# EAGLE design M8330 (EAGLE 6.6.0)
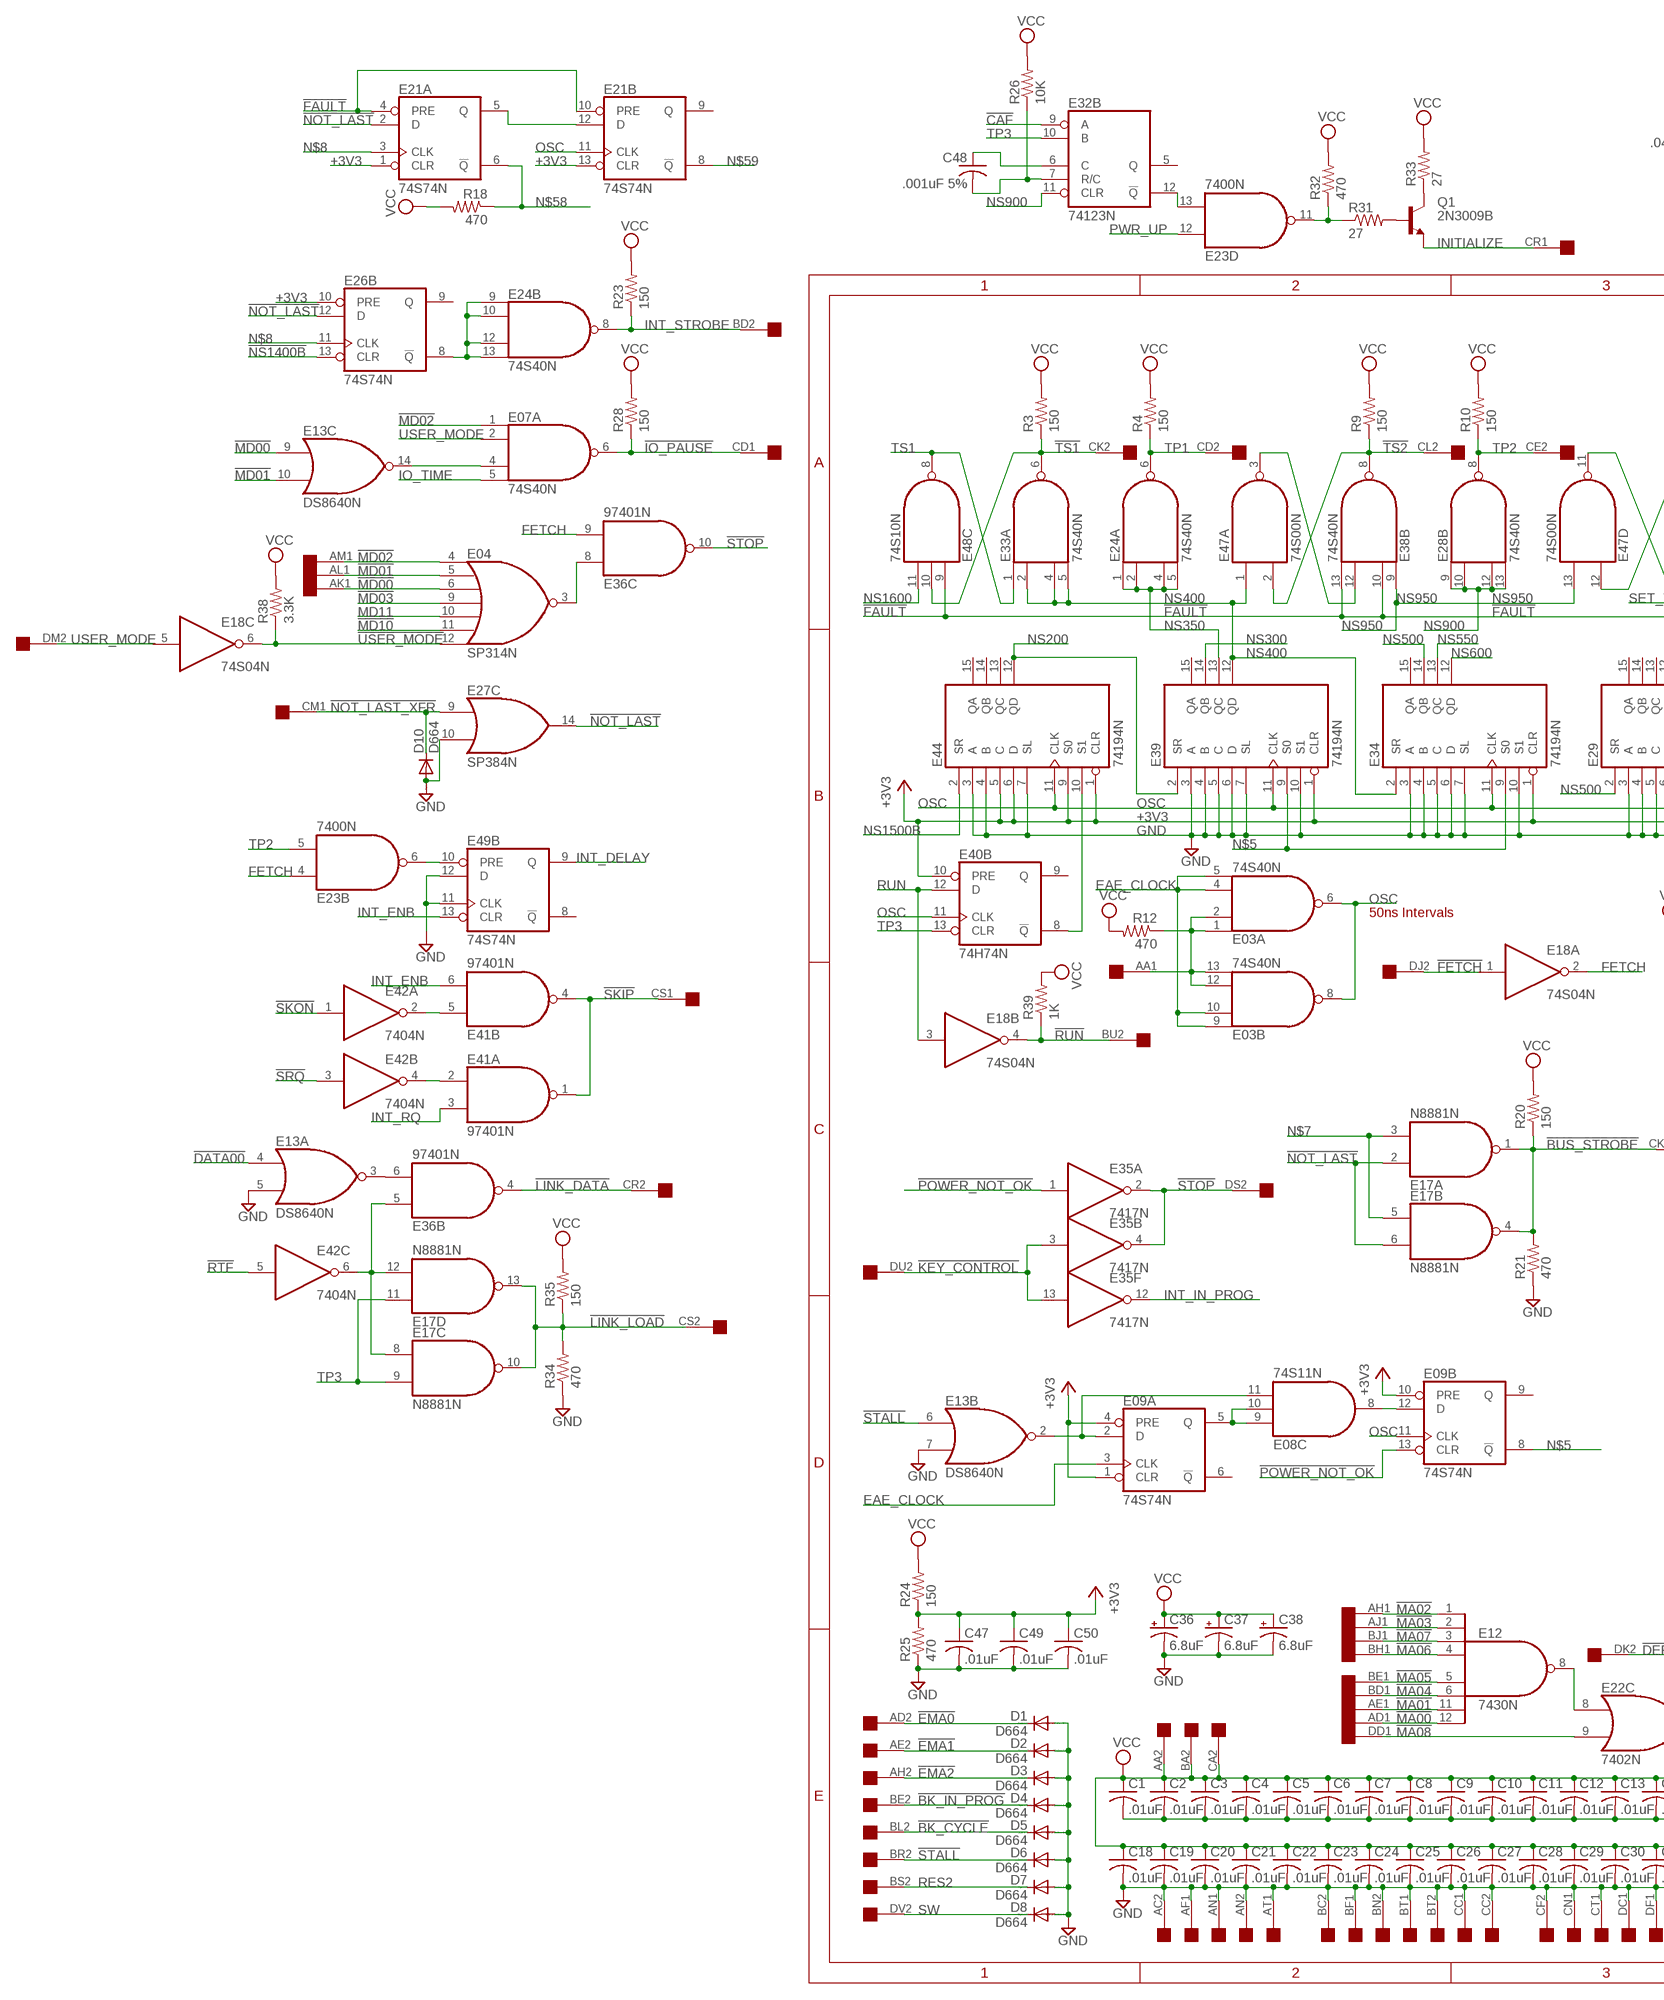
[diagram p0: schematic, sheet 1, part 1 of 2]
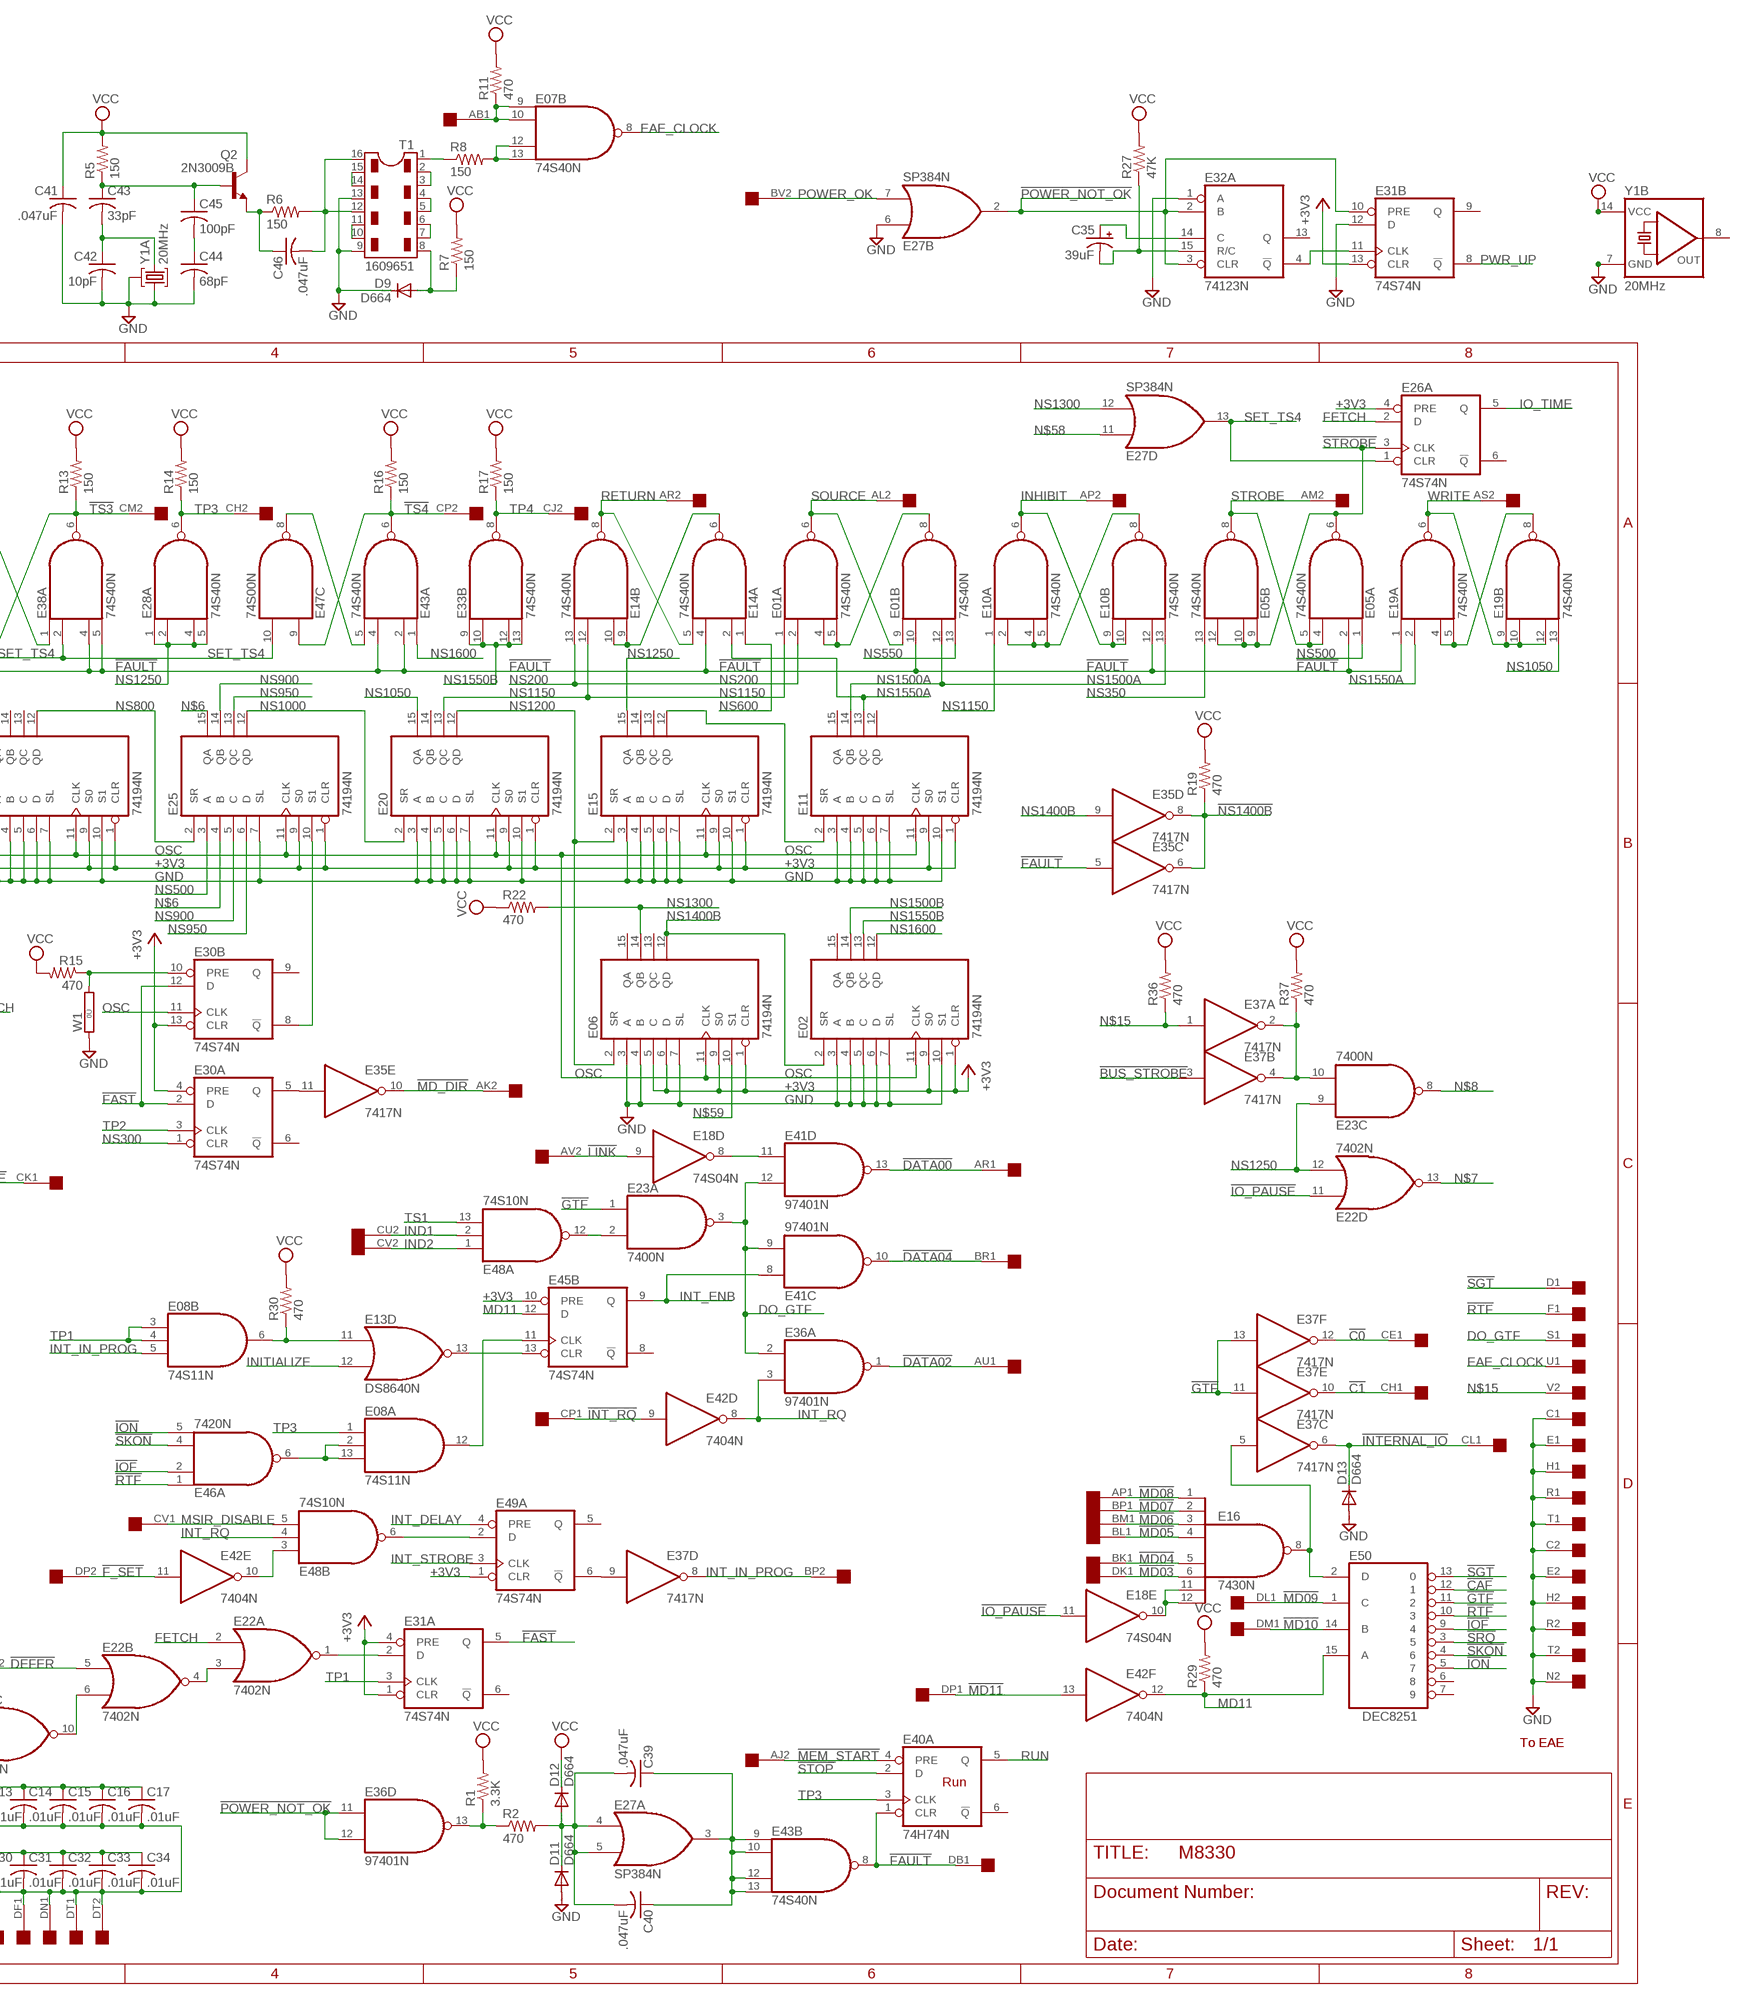
[diagram p1: schematic, sheet 1, part 2 of 2]

## Parts
C1  .01uF  C-US050-025X075  [C050-025X075]
C2  .01uF  C-US050-025X075  [C050-025X075]
C3  .01uF  C-US050-025X075  [C050-025X075]
C4  .01uF  C-US050-025X075  [C050-025X075]
C5  .01uF  C-US050-025X075  [C050-025X075]
C6  .01uF  C-US050-025X075  [C050-025X075]
C7  .01uF  C-US050-025X075  [C050-025X075]
C8  .01uF  C-US050-025X075  [C050-025X075]
C9  .01uF  C-US050-025X075  [C050-025X075]
C10  .01uF  C-US050-025X075  [C050-025X075]
C11  .01uF  C-US050-025X075  [C050-025X075]
C12  .01uF  C-US050-025X075  [C050-025X075]
C13  .01uF  C-US050-025X075  [C050-025X075]
C14  .01uF  C-US050-025X075  [C050-025X075]
C15  .01uF  C-US050-025X075  [C050-025X075]
C16  .01uF  C-US050-025X075  [C050-025X075]
C17  .01uF  C-US050-025X075  [C050-025X075]
C18  .01uF  C-US050-025X075  [C050-025X075]
C19  .01uF  C-US050-025X075  [C050-025X075]
C20  .01uF  C-US050-025X075  [C050-025X075]
C21  .01uF  C-US050-025X075  [C050-025X075]
C22  .01uF  C-US050-025X075  [C050-025X075]
C23  .01uF  C-US050-025X075  [C050-025X075]
C24  .01uF  C-US050-025X075  [C050-025X075]
C25  .01uF  C-US050-025X075  [C050-025X075]
C26  .01uF  C-US050-025X075  [C050-025X075]
C27  .01uF  C-US050-025X075  [C050-025X075]
C28  .01uF  C-US050-025X075  [C050-025X075]
C29  .01uF  C-US050-025X075  [C050-025X075]
C30  .01uF  C-US050-025X075  [C050-025X075]
C31  .01uF  C-US050-025X075  [C050-025X075]
C32  .01uF  C-US050-025X075  [C050-025X075]
C33  .01uF  C-US050-025X075  [C050-025X075]
C34  .01uF  C-US050-025X075  [C050-025X075]
C35  39uF  CPOL-USE20-8AXIAL  [E12-8]
C36  6.8uF  CPOL-USE20-8AXIAL  [E12-8]
C37  6.8uF  CPOL-USE20-8AXIAL  [E12-8]
C38  6.8uF  CPOL-USE20-8AXIAL  [E12-8]
C39  .047uF  C-US050-025X075  [C050-025X075]
C40  .047uF  C-US050-025X075  [C050-025X075]
C41  .047uF  C-US050-025X075  [C050-025X075]
C42  10pF  C-US050-025X075  [C050-025X075]
C43  33pF  C-US050-025X075  [C050-025X075]
C44  68pF  C-US050-025X075  [C050-025X075]
C45  100pF  C-US050-025X075  [C050-025X075]
C46  .047uF  C-US050-025X075  [C050-025X075]
C47  .01uF  C-US050-025X075  [C050-025X075]
C48  .001uF 5%  C-US050-025X075  [C050-025X075]
C49  .01uF  C-US050-025X075  [C050-025X075]
C50  .01uF  C-US050-025X075  [C050-025X075]
D1  D664  1N4148DO35-10  [DO35-10]
D2  D664  1N4148DO35-10  [DO35-10]
D3  D664  1N4148DO35-10  [DO35-10]
D4  D664  1N4148DO35-10  [DO35-10]
D5  D664  1N4148DO35-10  [DO35-10]
D6  D664  1N4148DO35-10  [DO35-10]
D7  D664  1N4148DO35-10  [DO35-10]
D8  D664  1N4148DO35-10  [DO35-10]
D9  D664  1N4148DO35-10  [DO35-10]
D10  D664  1N4148DO35-10  [DO35-10]
D11  D664  1N4148DO35-10  [DO35-10]
D12  D664  1N4148DO35-10  [DO35-10]
D13  D664  1N4148DO35-10  [DO35-10]
E01  74S40N  74S20N  [DIL14]
E02  74194N  74S194N  [DIL16]
E03  74S40N  74S20N  [DIL14]
E04  SP314N  [DIL14]
E05  74S40N  74S20N  [DIL14]
E06  74194N  74S194N  [DIL16]
E07  74S40N  74S20N  [DIL14]
E08  74S11N  [DIL14]
E09  74S74N  [DIL14]
E10  74S40N  74S20N  [DIL14]
E11  74194N  74S194N  [DIL16]
E12  7430N  [DIL14]
E13  DS8640N  [DIL14]
E14  74S40N  74S20N  [DIL14]
E15  74194N  74S194N  [DIL16]
E16  7430N  [DIL14]
E17  N8881N  [DIL14]
E18  74S04N  [DIL14]
E19  74S40N  74S20N  [DIL14]
E20  74194N  74S194N  [DIL16]
E21  74S74N  [DIL14]
E22  7402N  [DIL14]
E23  7400N  [DIL14]
E24  74S40N  74S20N  [DIL14]
E25  74194N  74S194N  [DIL16]
E26  74S74N  [DIL14]
E27  SP384N  [DIL14]
E28  74S40N  74S20N  [DIL14]
E29  74194N  74S194N  [DIL16]
E30  74S74N  [DIL14]
E31  74S74N  [DIL14]
E32  74123N  [DIL16]
E33  74S40N  74S20N  [DIL14]
E34  74194N  74S194N  [DIL16]
E35  7417N  [DIL14]
E36  97401N  74LS01N  [DIL14]
E37  7417N  [DIL14]
E38  74S40N  74S20N  [DIL14]
E39  74194N  74S194N  [DIL16]
E40  74H74N  74S74N  [DIL14]
E41  97401N  74LS01N  [DIL14]
E42  7404N  [DIL14]
E43  74S40N  74S20N  [DIL14]
E44  74194N  74S194N  [DIL16]
E45  74S74N  [DIL14]
E46  7420N  74LS20N  [DIL14]
E47  74S00N  [DIL14]
E48  74S10N  [DIL14]
E49  74S74N  [DIL14]
E50  DEC8251  [DIL16]
J  SINGLE  [EDGE-CON2]
Q1  2N3009B  -NPN-TO5  [TO5]
Q2  2N3009B  -NPN-TO5  [TO5]
R1  3.3K  R-US_0207/10  [0207/10]
R2  470  R-US_0207/10  [0207/10]
R3  150  R-US_0207/10  [0207/10]
R4  150  R-US_0207/10  [0207/10]
R5  150  R-US_0207/10  [0207/10]
R6  150  R-US_0207/10  [0207/10]
R7  150  R-US_0207/10  [0207/10]
R8  150  R-US_0207/10  [0207/10]
R9  150  R-US_0207/10  [0207/10]
R10  150  R-US_0207/10  [0207/10]
R11  470  R-US_0207/10  [0207/10]
R12  470  R-US_0207/10  [0207/10]
R13  150  R-US_0207/10  [0207/10]
R14  150  R-US_0207/10  [0207/10]
R15  470  R-US_0207/10  [0207/10]
R16  150  R-US_0207/10  [0207/10]
R17  150  R-US_0207/10  [0207/10]
R18  470  R-US_0207/10  [0207/10]
R19  470  R-US_0207/10  [0207/10]
R20  150  R-US_0207/10  [0207/10]
R21  470  R-US_0207/10  [0207/10]
R22  470  R-US_0207/10  [0207/10]
R23  150  R-US_0207/10  [0207/10]
R24  150  R-US_0207/10  [0207/10]
R25  470  R-US_0207/10  [0207/10]
R26  10K  R-US_0207/10  [0207/10]
R27  47K  R-US_0207/10  [0207/10]
R28  150  R-US_0207/10  [0207/10]
R29  470  R-US_0207/10  [0207/10]
R30  470  R-US_0207/10  [0207/10]
R31  27  R-US_0207/10  [0207/10]
R32  470  R-US_0207/10  [0207/10]
R33  27  R-US_0207/10  [0207/10]
R34  470  R-US_0207/10  [0207/10]
R35  150  R-US_0207/10  [0207/10]
R36  470  R-US_0207/10  [0207/10]
R37  470  R-US_0207/10  [0207/10]
R38  3.3K  R-US_0207/10  [0207/10]
R39  1K  R-US_0207/10  [0207/10]
T1  1609651  DIL16  [DIL16]
U$2  QUAD  [EDGE-CON8]
W1  0R  [0R/10]
Y1A  20MHz  HC49TL-H  [HC49TL-H]
Y1B  20MHz  QG5860  [DIL14S]

## Nets
!BK_CYCLE: D5.C U$2.BL2
!BK_IN_PROG: D4.C U$2.BE2
!BUS_STROBE: E17.1(A:O) E17.4(B:O) E37.3(B:I) R20.1 R21.2 U$2.CK1
!C0: E37.12(F:O) U$2.CE1
!C1: E37.10(E:O) U$2.CH1
!CAF: E32.9(B:A) E50.12
!DATA00: E13.4(A:I0) E41.13(D:O) U$2.AR1
!DATA02: E36.1(A:O) U$2.AU1
!DATA04: E41.10(C:O) U$2.BR1
!DEFER: E22.5(B:I0) U$2.DK2
!EMA0: D1.C U$2.AD2
!EMA1: D2.C U$2.AE2
!EMA2: D3.C U$2.AH2
!F_SET: E42.11(E:I) U$2.DP2
!FAST: E30.2(A:D) E30.12(B:D) E31.5(A:Q)
!FAULT: E01.10(B:I1) E05.2(A:I1) E10.12(B:I2) E14.4(A:I2) E19.1(A:I0) E21.4(A:PRE) E21.10(B:PRE) E35.5(C:I) E38.4(A:I2) E38.5(A:I3) E38.10(B:I1) E38.13(B:I3) E40.1(A:CLR) E43.2(A:I1) E43.4(A:I2) E43.8(B:O) E48.9(C:I0) U$2.DB1
!FETCH: E18.1(A:I) U$2.DJ2
!GTF: E23.1(A:I0) E37.11(E:I) E37.13(F:I) E50.11
!INT_RQ: E42.9(D:I) U$2.CP1
!INTERNAL_IO: D13.C E37.6(C:O) U$2.CL1
!IO_PAUSE: E07.6(A:O) E18.11(E:I) E22.11(D:I0) R28.1 U$2.CD1
!IOF: E46.2(A:I1) E50.9
!ION: E46.5(A:I3) E50.5
!KEY_CONTROL: E35.3(B:I) E35.13(F:I) U$2.DU2
!LINK: E18.9(D:I) U$2.AV2
!LINK_DATA: E36.4(B:O) U$2.CR2
!LINK_LOAD: E17.10(C:O) E17.13(D:O) R34.2 R35.1 U$2.CS2
!MA00: E12.12(I7) U$2.AD1
!MA01: E12.11(I6) U$2.AE1
!MA02: E12.1(I0) U$2.AH1
!MA03: E12.2(I1) U$2.AJ1
!MA04: E12.6(I5) U$2.BD1
!MA05: E12.5(I4) U$2.BE1
!MA06: E12.4(I3) U$2.BH1
!MA07: E12.3(I2) U$2.BJ1
!MA08: E22.9(C:I1) U$2.DD1
!MD00: E04.6(I2) E13.9(C:I0) U$2.AK1
!MD01: E04.5(I1) E13.10(C:I1) U$2.AL1
!MD02: E04.4(I0) E07.1(A:I0) U$2.AM1
!MD03: E04.9(I3) E16.6(I5) U$2.DK1
!MD04: E16.5(I4) U$2.BK1
!MD05: E16.4(I3) U$2.BL1
!MD06: E16.3(I2) U$2.BM1
!MD07: E16.2(I1) U$2.BP1
!MD08: E16.1(I0) U$2.AP1
!MD09: E50.1(C) U$2.DL1
!MD10: E04.11(I5) E50.14(B) U$2.DM1
!MD11: E42.13(F:I) U$2.DP1
!MD_DIR: E35.10(E:O) U$2.AK2
!MEM_START: E40.4(A:PRE) U$2.AJ2
!NOT_LAST: E17.2(A:I0) E17.6(B:I1) E21.2(A:D) E26.12(B:D) E27.14(C:O)
!NOT_LAST_XFR: D10.C E27.9(C:I0) U$2.CM1
!NS1400B: E26.13(B:CLR) E35.6(C:O) E35.8(D:O) R19.1
!POWER_NOT_OK: E09.13(B:CLR) E27.2(B:O) E31.10(B:PRE) E32.2(A:B) E32.3(A:CLR) E35.1(A:I) E36.11(D:I0) E36.12(D:I1)
!RTF: E42.5(C:I) E46.1(A:I0) E50.10 J.F1
!RUN: E18.4(B:O) R39.1 U$2.BU2
!SGT: E50.13 J.D1
!SKIP: E41.1(A:O) E41.4(B:O) U$2.CS1
!SKON: E42.1(A:I) E46.4(A:I2) E50.4
!SRQ: E42.3(B:I) E50.3
!STALL: D6.C E13.6(B:I0) U$2.BR2
!STOP: E35.2(A:O) E35.4(B:O) E36.10(C:O) E40.2(A:D) U$2.DS2
!STROBE: E05.6(A:O) E05.9(B:I0) E05.10(B:I1) E05.12(B:I2) E26.3(A:CLK)
!TS1: E33.6(A:O) E48.10(C:I1) R3.1 U$2.CK2
!TS2: E38.8(B:O) E47.2(A:I1) R9.1 U$2.CL2
!TS3: E38.6(A:O) E47.12(D:I0) R13.1 U$2.CM2
!TS4: E43.6(A:O) E47.9(C:I0) R16.1 U$2.CP2
!USER_MODE: E04.12(I6) E18.6(C:O) R38.1
+3V3: C47.1 C49.1 C50.1 E02.1(CLR) E02.9(S0) E06.1(CLR) E06.5(C) E06.6(D) E06.9(S0) E09.1(A:CLR) E09.4(A:PRE) E09.10(B:PRE) E11.1(CLR) E11.9(S0) E15.1(CLR) E15.9(S0) E20.1(CLR) E20.9(S0) E21.1(A:CLR) E21.13(B:CLR) E25.1(CLR) E25.9(S0) E26.4(A:PRE) E26.10(B:PRE) E29.1(CLR) E29.9(S0) E30.4(A:PRE) E30.13(B:CLR) E31.1(A:CLR) E31.4(A:PRE) E31.13(B:CLR) E34.1(CLR) E39.1(CLR) E40.10(B:PRE) E44.1(CLR) E44.5(C) E44.6(D) E44.9(S0) E45.10(B:PRE) E49.1(A:CLR) R24.1 R25.2
DO_GTF: E23.3(A:O) E36.2(A:I0) E41.9(C:I1) E41.12(D:I1) J.S1
EAE_CLOCK: E03.4(A:I2) E03.5(A:I3) E03.9(B:I0) E03.10(B:I1) E07.8(B:O) E09.3(A:CLK) J.U1
F_SET: E42.10(E:O) E48.3(B:I0)
FETCH: E18.2(A:O) E22.2(A:I0) E23.4(B:I0) E26.2(A:D) E36.9(C:I1)
GND [Supply]: C1.2 C2.2 C3.2 C4.2 C5.2 C6.2 C7.2 C8.2 C9.2 C10.2 C11.2 C12.2 C13.2 C14.2 C15.2 C16.2 C17.2 C18.2 C19.2 C20.2 C21.2 C22.2 C23.2 C24.2 C25.2 C26.2 C27.2 C28.2 C29.2 C30.2 C31.2 C32.2 C33.2 C34.2 C36.- C37.- C38.- C41.2 C42.2 C44.2 C47.2 C49.2 C50.2 D1.A D2.A D3.A D4.A D5.A D6.A D7.A D8.A D9.C D10.A D11.A D13.A E02.3(A) E02.4(B) E02.5(C) E02.6(D) E02.7(SL) E02.10(S1) E06.3(A) E06.4(B) E06.7(SL) E11.3(A) E11.4(B) E11.5(C) E11.6(D) E11.7(SL) E11.10(S1) E13.5(A:I1) E13.7(B:I1) E15.3(A) E15.4(B) E15.5(C) E15.6(D) E15.7(SL) E15.10(S1) E20.3(A) E20.4(B) E20.5(C) E20.6(D) E20.7(SL) E20.10(S1) E25.7(SL) E27.6(B:I0) E27.10(C:I1) E29.3(A) E29.4(B) E29.5(C) E29.6(D) E29.7(SL) E29.10(S1) E31.12(B:D) E32.1(A:A) E34.3(A) E34.4(B) E34.5(C) E34.6(D) E34.7(SL) E34.10(S1) E39.3(A) E39.4(B) E39.5(C) E39.6(D) E39.7(SL) E39.10(S1) E44.3(A) E44.4(B) E44.7(SL) E49.11(B:CLK) E49.12(B:D) J.C1 J.C2 J.E1 J.E2 J.H1 J.H2 J.N2 J.R1 J.R2 J.T1 J.T2 R21.1 R25.1 R34.1 T1.9 T1.13 U$2.AC2 U$2.AF1 U$2.AN1 U$2.AN2 U$2.AT1 U$2.BC2 U$2.BF1 U$2.BN2 U$2.BT1 U$2.BT2 U$2.CC1 U$2.CC2 U$2.CF2 U$2.CN1 U$2.CT1 U$2.DC1 U$2.DF1 U$2.DN1 U$2.DT1 U$2.DT2 W1.1 Y1A.1 Y1A.3 Y1B.7(GND)
IND1: E48.2(A:I1) U$2.CU2
IND2: E48.1(A:I0) U$2.CV2
INHIBIT: E10.6(A:O) E10.9(B:I0) E10.10(B:I1) U$2.AP2
INITIALIZE: E13.12(D:I1) Q1.1(E) U$2.CR1
INT_DELAY: E49.4(A:PRE) E49.9(B:Q)
INT_ENB: E41.6(B:I1) E41.8(C:I0) E45.9(B:Q) E49.13(B:CLR)
INT_IN_PROG: E08.5(B:I2) E35.12(F:O) E37.8(D:O) U$2.BP2
INT_RQ: E36.3(A:I1) E41.3(A:I1) E42.8(D:O) E48.4(B:I1)
INT_STROBE: E24.8(B:O) E49.3(A:CLK) R23.1 U$2.BD2
IO_TIME: E07.5(A:I3) E26.5(A:Q)
MD11: E04.10(I4) E42.12(F:O) E45.12(B:D) E50.15(A) R29.1
MSIR_DISABLE: E48.5(B:I2) U$2.CV1
N$1: E16.8(O) E37.5(C:I) E50.2(D)
N$2: E23.10(C:I1) E37.2(A:O) E37.4(B:O) R37.1
N$3: E04.3(O) E36.8(C:I0)
N$4: E40.8(B:!Q) E44.10(S1)
N$5: E09.8(B:!Q) E34.9(S0) E39.9(S0)
N$6: E25.4(B) E25.15(QA)
N$7: E17.3(A:I1) E17.5(B:I0) E22.13(D:O)
N$8: E21.3(A:CLK) E23.8(C:O) E26.11(B:CLK)
N$9: E18.8(D:O) E41.11(D:I0)
N$11: C42.1 C43.2 Y1A.2
N$12: E03.1(A:I0) E03.2(A:I1) E03.12(B:I2) E03.13(B:I3) R12.1 U$2.AA1
N$13: E07.9(B:I0) E07.10(B:I1) R11.1 U$2.AB1
N$14: E12.8(O) E22.8(C:I0)
N$15: E37.1(A:I) J.V2 R36.1
N$16: E08.11(C:I2) E09.2(A:D) E13.2(B:O)
N$17: C48.2 E32.7(B:R/C) R26.1
N$18: E16.11(I6) E16.12(I7) E18.10(E:O)
N$19: E23.13(D:I1) E32.12(B:!Q)
N$20: C48.1 E32.6(B:C)
N$21: Q1.3(C) R33.1
N$22: Q1.2(B) R31.2
N$23: E23.11(D:O) R31.1 R32.1
N$24: E31.11(B:CLK) E32.4(A:!Q)
N$25: C43.1 C45.1 Q2.2(B) R5.1
N$26: C39.1 C40.1 E27.3(A:O) E43.9(B:I0) E43.10(B:I1) E43.12(B:I2) E43.13(B:I3)
N$27: C39.2 C40.2 D11.C D12.A E27.4(A:I0) E27.5(A:I1) R2.2
N$28: C46.2 R6.2 T1.12 T1.16
N$29: E36.13(D:O) R1.1 R2.1
N$30: C44.1 C45.2
N$31: C46.1 Q2.1(E) R6.1
N$32: R8.1 T1.1
N$33: T1.10 T1.11
N$34: T1.6 T1.7
N$35: T1.14 T1.15
N$36: T1.2 T1.3
N$37: T1.4 T1.5
N$38 [Supply]: D9.A R7.1 T1.8
N$39: E07.12(B:I2) E07.13(B:I3) R8.2
N$40: E22.6(B:I1) E22.10(C:O)
N$41: E08.9(C:I0) E08.10(C:I1) E09.5(A:Q)
N$42: E08.8(C:O) E09.12(B:D)
N$44: E38.12(B:I2) E47.3(A:O)
N$45: C35.+ E32.14(A:C)
N$46: C35.- E32.15(A:R/C) R27.1
N$47: E38.1(A:I0) E47.11(D:O)
N$48: E14.6(A:O) E14.9(B:I0) E14.10(B:I1)
N$49: E10.2(A:I1) E10.4(A:I2) E10.5(A:I3) E10.8(B:O)
N$50: E43.5(A:I3) E47.8(C:O)
N$51: E01.4(A:I2) E01.5(A:I3) E01.8(B:O)
N$53: E25.10(S1) E30.8(B:!Q)
N$54: E30.5(A:Q) E35.11(E:I)
N$55: E19.4(A:I2) E19.5(A:I3) E19.8(B:O)
N$56: E30.10(B:PRE) R15.1 W1.2
N$57: E21.5(A:Q) E21.12(B:D)
N$58: E21.6(A:!Q) E27.11(D:I0) R18.1
N$59: E06.10(S1) E21.8(B:!Q)
N$60: E24.9(B:I0) E24.10(B:I1) E24.12(B:I2) E24.13(B:I3) E26.8(B:!Q)
N$61: E22.1(A:O) E31.2(A:D)
N$62: E07.4(A:I2) E13.14(C:O)
N$63: E22.3(A:I1) E22.4(B:O)
N$64: E23.2(A:I1) E48.12(A:O)
N$66: E08.12(A:O) E45.11(B:CLK)
N$67: E08.6(B:O) E13.11(D:I0) R30.1
N$69: E37.9(D:I) E49.6(A:!Q)
N$70: E13.13(D:O) E45.13(B:CLR)
N$71: E08.2(A:I1) E08.13(A:I2) E46.6(A:O)
N$72: E41.5(B:I0) E42.2(A:O)
N$73: E23.6(B:O) E49.10(B:PRE)
N$74: E48.6(B:O) E49.2(A:D)
N$75: E41.2(A:I0) E42.4(B:O)
N$77: E17.8(C:I0) E17.12(D:I1) E36.5(B:I0) E42.6(C:O)
N$78: E13.3(A:O) E36.6(B:I1)
NS200: E01.2(A:I1) E14.13(B:I3) E39.2(SR) E44.12(QD)
NS300: E30.1(A:CLR) E39.14(QB)
NS350: E05.13(B:I3) E24.1(A:I0) E24.2(A:I1) E24.4(A:I2) E24.5(A:I3) E39.13(QC)
NS400: E33.2(A:I1) E33.4(A:I2) E33.5(A:I3) E34.2(SR) E39.12(QD) E47.1(A:I0)
NS500: E05.1(A:I0) E25.3(A) E29.2(SR) E34.14(QB)
NS550: E01.13(B:I3) E34.13(QC)
NS600: E14.1(A:I0) E34.12(QD)
NS800: E25.2(SR) E29.12(QD)
NS900: E25.5(C) E25.14(QB) E28.9(B:I0) E28.10(B:I1) E28.12(B:I2) E28.13(B:I3) E32.11(B:CLR)
NS950: E25.6(D) E25.13(QC) E38.9(B:I0) E47.13(D:I1)
NS1000: E20.2(SR) E25.12(QD)
NS1050: E19.13(B:I3) E20.15(QA)
NS1150: E01.1(A:I0) E10.1(A:I0) E14.12(B:I2) E20.13(QC)
NS1200: E06.2(SR) E15.2(SR) E20.12(QD)
NS1250: E15.15(QA) E22.12(D:I1) E23.9(C:I0) E28.1(A:I0) E28.2(A:I1) E28.4(A:I2) E28.5(A:I3)
NS1300: E06.14(QB) E27.12(D:I1) R22.2
NS1400A: E11.2(SR) E15.12(QD)
NS1400B: E02.2(SR) E06.12(QD) E35.9(D:I)
NS1500A: E01.12(B:I2) E10.13(B:I3) E11.14(QB)
NS1500B: E02.14(QB) E44.2(SR)
NS1550A: E11.13(QC) E14.2(A:I1) E19.2(A:I1)
NS1550B: E02.13(QC) E33.9(B:I0) E33.10(B:I1) E33.12(B:I2) E33.13(B:I3)
NS1600: E02.12(QD) E43.1(A:I0) E48.11(C:I2)
OSC: E02.11(CLK) E03.6(A:O) E03.8(B:O) E06.11(CLK) E09.11(B:CLK) E11.11(CLK) E15.11(CLK) E20.11(CLK) E21.11(B:CLK) E25.11(CLK) E29.11(CLK) E30.11(B:CLK) E34.11(CLK) E39.11(CLK) E40.11(B:CLK) E44.11(CLK)
POWER_OK: E27.7(B:I1) U$2.BV2
PWR_UP: E23.12(D:I0) E31.8(B:!Q)
RES2: D7.C U$2.BS2
RETURN: E14.5(A:I3) E14.8(B:O) U$2.AR2
RUN: E18.3(B:I) E40.5(A:Q) E40.12(B:D)
SET_TS4: E26.1(A:CLR) E27.13(D:O) E38.2(A:I1) E47.10(C:I1)
SOURCE: E01.6(A:O) E01.9(B:I0) U$2.AL2
STROBE: E05.4(A:I2) E05.5(A:I3) E05.8(B:O) U$2.AM2
SW: D8.C U$2.DV2
TP1: E08.3(B:I0) E08.4(B:I1) E24.6(A:O) E31.3(A:CLK) R4.1 U$2.CD2
TP2: E23.5(B:I1) E28.8(B:O) E30.3(A:CLK) R10.1 U$2.CE2
TP3: E08.1(A:I0) E17.9(C:I1) E17.11(D:I0) E28.6(A:O) E32.10(B:B) E40.3(A:CLK) E40.13(B:CLR) R14.1 U$2.CH2
TP4: E33.8(B:O) R17.1 U$2.CJ2
TS1: E33.1(A:I0) E48.8(C:O) E48.13(A:I2)
USER_MODE: E07.2(A:I1) E18.5(C:I) U$2.DM2
VCC [Supply]: C1.1 C2.1 C3.1 C4.1 C5.1 C6.1 C7.1 C8.1 C9.1 C10.1 C11.1 C12.1 C13.1 C14.1 C15.1 C16.1 C17.1 C18.1 C19.1 C20.1 C21.1 C22.1 C23.1 C24.1 C25.1 C26.1 C27.1 C28.1 C29.1 C30.1 C31.1 C32.1 C33.1 C34.1 C36.+ C37.+ C38.+ C41.1 D12.C Q2.3(C) R1.2 R3.2 R4.2 R5.2 R7.2 R9.2 R10.2 R11.2 R12.2 R13.2 R14.2 R15.2 R16.2 R17.2 R18.2 R19.2 R20.2 R22.1 R23.2 R24.2 R26.2 R27.2 R28.2 R29.2 R30.2 R32.2 R33.2 R35.2 R36.2 R37.2 R38.2 R39.2 U$2.AA2 U$2.BA2 U$2.CA2 Y1B.14(VCC)
WRITE: E19.6(A:O) E19.9(B:I0) E19.10(B:I1) E19.12(B:I2) U$2.AS2
Unconnected: E02.15(QA) E06.13(QC) E06.15(QA) E09.6(A:!Q) E09.9(B:Q) E11.12(QD) E11.15(QA) E15.13(QC) E15.14(QB) E18.12(F:O) E18.13(F:I) E20.14(QB) E21.9(B:Q) E26.6(A:!Q) E26.9(B:Q) E29.13(QC) E29.14(QB) E29.15(QA) E30.6(A:!Q) E30.9(B:Q) E31.6(A:!Q) E31.9(B:Q) E32.5(B:Q) E32.13(A:Q) E34.15(QA) E39.15(QA) E40.6(A:!Q) E40.9(B:Q) E44.13(QC) E44.14(QB) E44.15(QA) E45.1(A:CLR) E45.2(A:D) E45.3(A:CLK) E45.4(A:PRE) E45.5(A:Q) E45.6(A:!Q) E45.8(B:!Q) E46.8(B:O) E46.9(B:I0) E46.10(B:I1) E46.12(B:I2) E46.13(B:I3) E47.4(B:I0) E47.5(B:I1) E47.6(B:O) E49.5(A:Q) E49.8(B:!Q) E50.6 E50.7 J.A1 J.A2 J.B1 J.B2 J.D2 J.F2 J.J1 J.J2 J.K1 J.K2 J.L1 J.L2 J.M1 J.M2 J.N1 J.P1 J.P2 J.S2 J.U2 J.V1 U$2.AB2 U$2.AC1 U$2.AF2 U$2.AS1 U$2.AT2 U$2.AU2 U$2.AV1 U$2.BA1 U$2.BB1 U$2.BB2 U$2.BC1 U$2.BF2 U$2.BH2 U$2.BJ2 U$2.BK2 U$2.BM2 U$2.BN1 U$2.BS1 U$2.BU1 U$2.BV1 U$2.CA1 U$2.CB1 U$2.CB2 U$2.CF1 U$2.CJ1 U$2.CN2 U$2.CT2 U$2.CU1 U$2.DA1 U$2.DA2 U$2.DB2 U$2.DC2 U$2.DD2 U$2.DE1 U$2.DE2 U$2.DF2 U$2.DH1 U$2.DH2 U$2.DJ1 U$2.DL2 U$2.DN2 U$2.DR1 U$2.DR2 U$2.DS1 U$2.DU1 U$2.DV1 Y1B.8(OUT)

## Notes on the sheet
- 50ns Intervals
- To EAE | To EAE
- Run

## Power pins joined to a net without a drawn wire
GND: E01.7(P:GND) E02.8(GND) E03.7(P:GND) E04.1(GND) E05.7(P:GND) E06.8(GND) E07.7(P:GND) E08.7(P:GND) E09.7(P:GND) E10.7(P:GND) E11.8(GND) E12.7(GND) E13.1(P:GND) E14.7(P:GND) E15.8(GND) E16.7(GND) E17.7(P:GND) E18.7(P:GND) E19.7(P:GND) E20.8(GND) E21.7(P:GND) E22.7(P:GND) E23.7(P:GND) E24.7(P:GND) E25.8(GND) E26.7(P:GND) E27.1(GND) E28.7(P:GND) E29.8(GND) E30.7(P:GND) E31.7(P:GND) E32.8(P:GND) E33.7(P:GND) E34.8(GND) E35.7(P:GND) E36.7(P:GND) E37.7(P:GND) E38.7(P:GND) E39.8(GND) E40.7(P:GND) E41.7(P:GND) E42.7(P:GND) E43.7(P:GND) E44.8(GND) E45.7(P:GND) E46.7(P:GND) E47.7(P:GND) E48.7(P:GND) E49.7(P:GND) E50.8(GND)
VCC: E01.14(P:VCC) E02.16(VCC) E03.14(P:VCC) E04.8(VCC) E05.14(P:VCC) E06.16(VCC) E07.14(P:VCC) E08.14(P:VCC) E09.14(P:VCC) E10.14(P:VCC) E11.16(VCC) E12.14(VCC) E13.8(P:VCC) E14.14(P:VCC) E15.16(VCC) E16.14(VCC) E17.14(P:VCC) E18.14(P:VCC) E19.14(P:VCC) E20.16(VCC) E21.14(P:VCC) E22.14(P:VCC) E23.14(P:VCC) E24.14(P:VCC) E25.16(VCC) E26.14(P:VCC) E27.8(VCC) E28.14(P:VCC) E29.16(VCC) E30.14(P:VCC) E31.14(P:VCC) E32.16(P:VCC) E33.14(P:VCC) E34.16(VCC) E35.14(P:VCC) E36.14(P:VCC) E37.14(P:VCC) E38.14(P:VCC) E39.16(VCC) E40.14(P:VCC) E41.14(P:VCC) E42.14(P:VCC) E43.14(P:VCC) E44.16(VCC) E45.14(P:VCC) E46.14(P:VCC) E47.14(P:VCC) E48.14(P:VCC) E49.14(P:VCC) E50.16(VCC)

## Library data of the parts
C1-C34 C39-C50 = rcl:C-US: CAPACITOR, American symbol
C35-C38 = dec-con:CPOL-USE20-8AXIAL: A 0.8 inch electrolytic.
D1-D13 = diode:1N4148: DIODE high speed (Philips)
E01 E03 E05 E07 E10 E14 E19 E24 E28 E33 E38 E43 E46 = 74xx-us:74*20: Dual 4-input NAND gate
E02 E06 E11 E15 E20 E25 E29 E34 E39 E44 = 74xx-us:74*194: 4-bit bidirectional SHIFT REGISTER
E04 = dec-con:SP314: 7-Input NOR gate
E08 = 74xx-us:74*11: Triple 3-input AND gate
E09 E21 E26 E30 E31 E40 E45 E49 = 74xx-us:74*74: Dual D type positive edge triggered FLIP FLOP, preset and clear
E12 E16 = 74xx-us:74*30: 8-input NAND gate
E13 = dec-con:DS8640: Quad NOR gate
E17 = dec-con:N8881: Quad 2-input NAND gate, open collector
E18 E42 = 74xx-us:74*04: Hex INVERTER
E22 = 74xx-us:74*02: Quad 2-input NOR gate
E23 E47 = 74xx-us:74*00: Quad 2-input NAND gate
E27 = dec-con:SP384: Quad OR gate
E32 = 74xx-us:74*123: Retriggerable monostable MULTIVIBRATOR
E35 E37 = 74xx-us:74*17: Hex INVERTER, open collector, high-voltage
E36 E41 = 74xx-us:74*01: Quad 2-input NAND gate, open collector
E48 = 74xx-us:74*10: Triple 3-input NAND gate
E50 = dec-con:DEC8251: BCD Decoder
J = dec-con:SINGLE: Single-Height DEC board
Q1 Q2 = transistor:*-NPN-: NPN Transistror BF959 corrected 2008.03.06
R1-R39 = rcl:R-US_: RESISTOR, American symbol
T1 = ic-package:DIL16: Dual In Line / Socket
U$2 = dec-con:QUAD: Quad-Height DEC board
W1 = jumper:0R: Bridge 0R 10mm
Y1A = crystal:HC49TL-H: CRYSTAL; OC_FARNELL: unknown; OC_NEWARK: unknown
Y1B = crystal:QG5860: CRYSTAL RESONATOR; OC_FARNELL: unknown; OC_NEWARK: unknown

## Net classes
1 Supply: width 0.813 mm

## Board
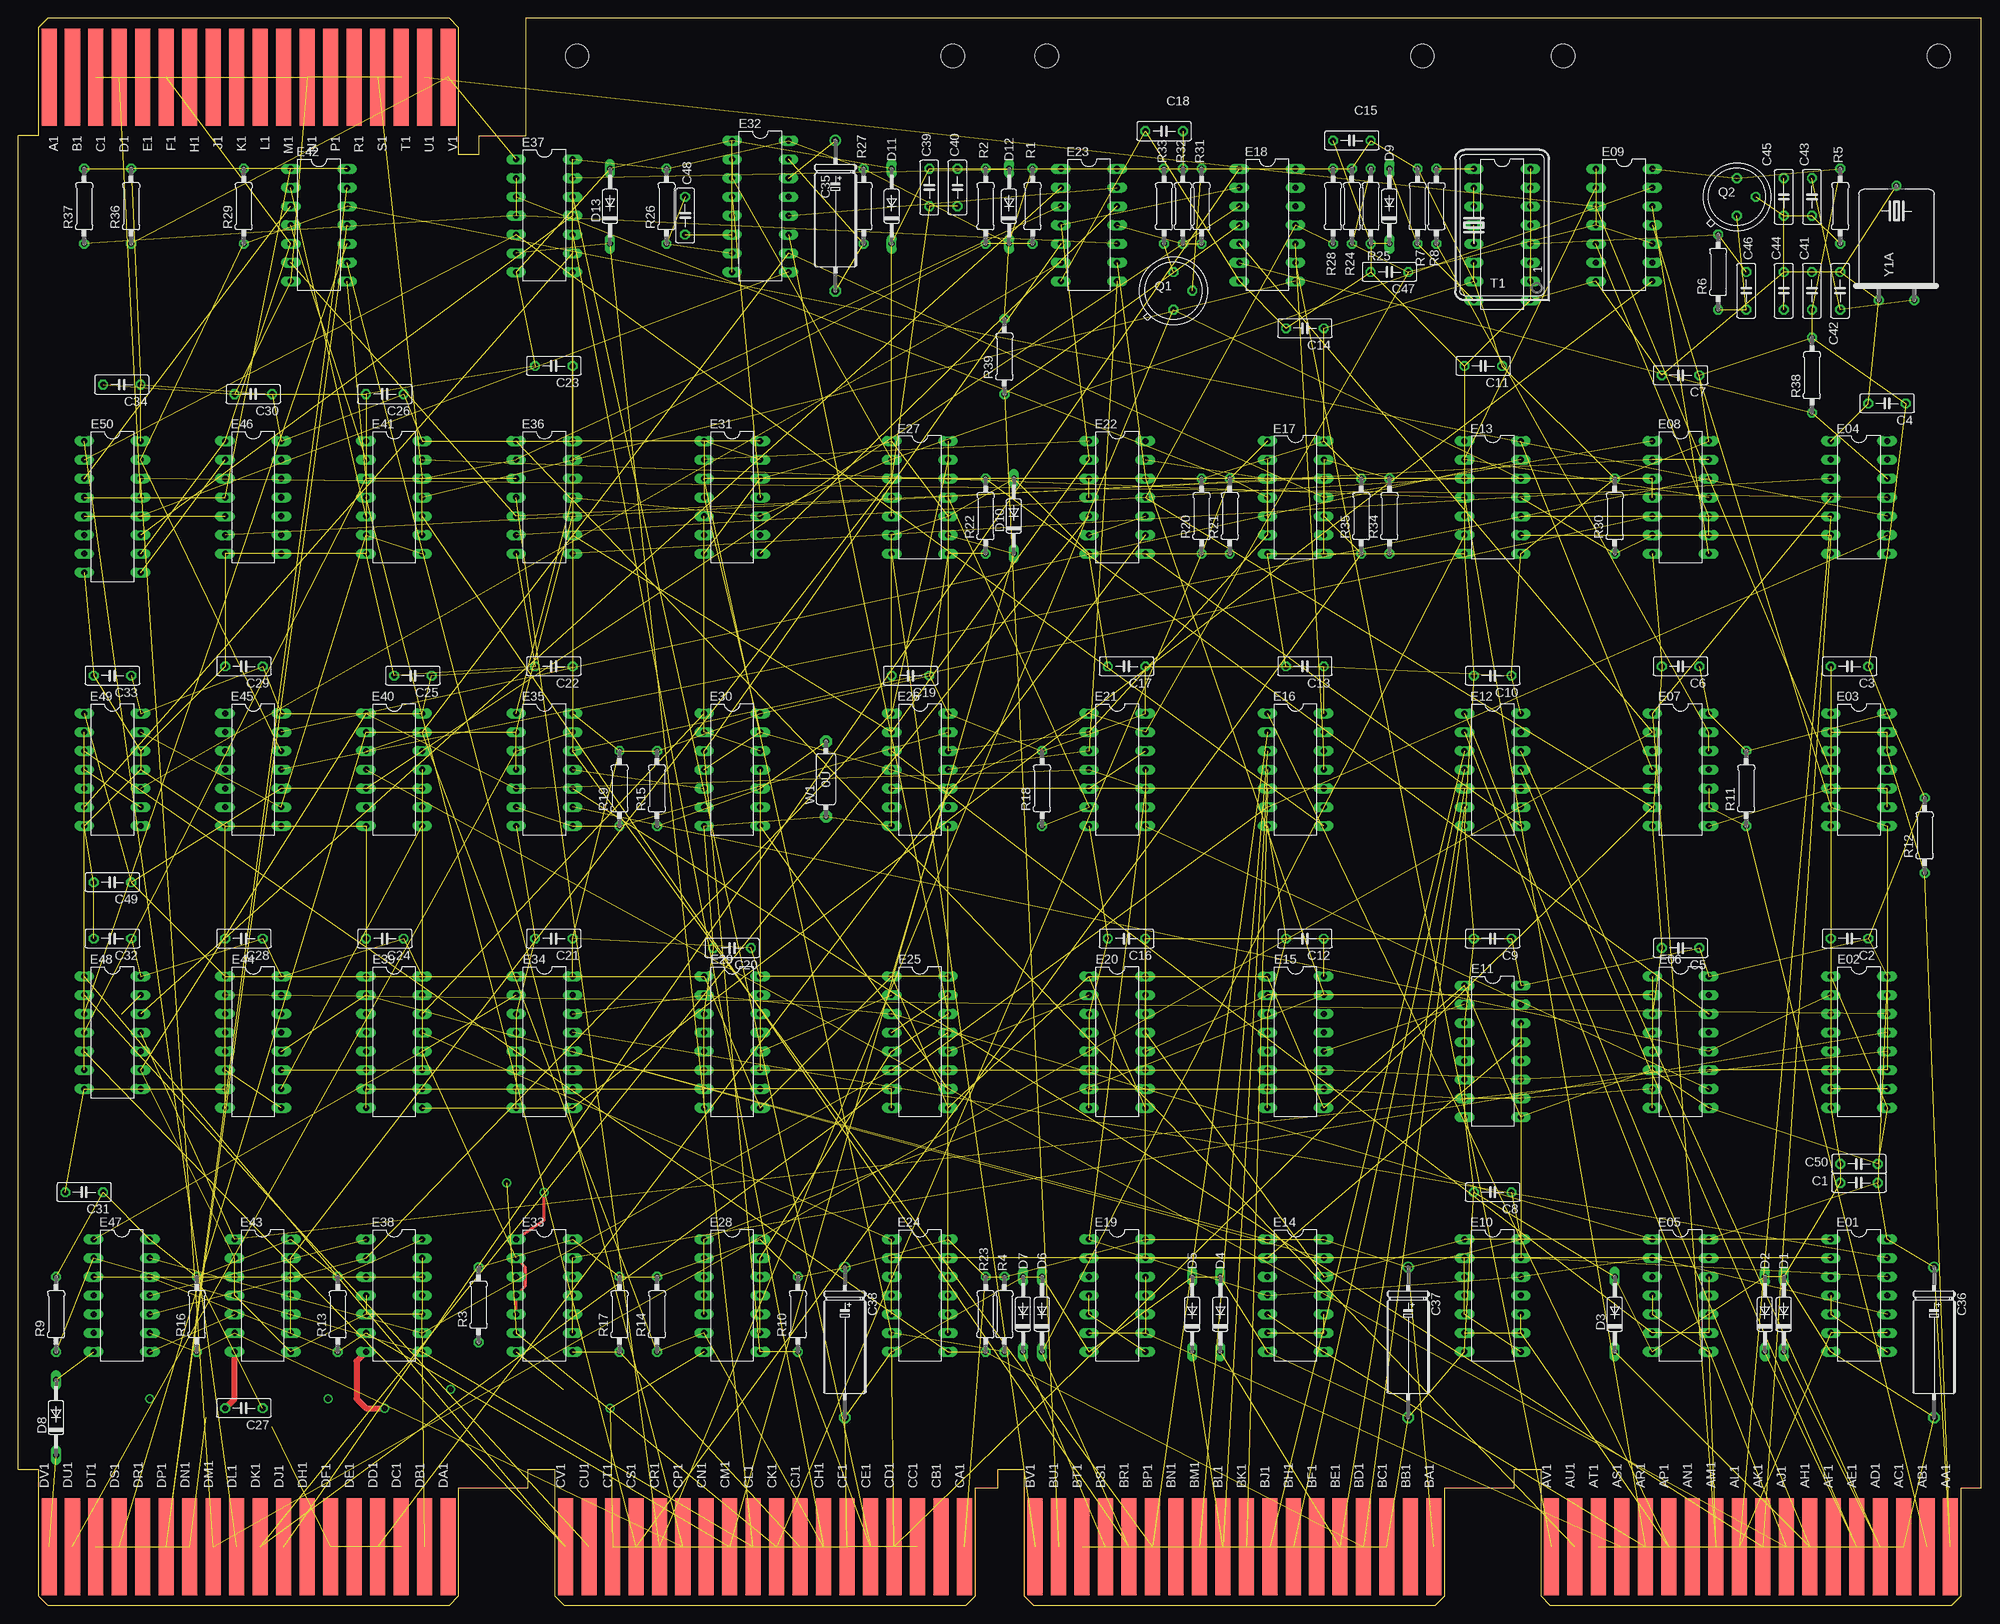
[diagram p2: board, top side]
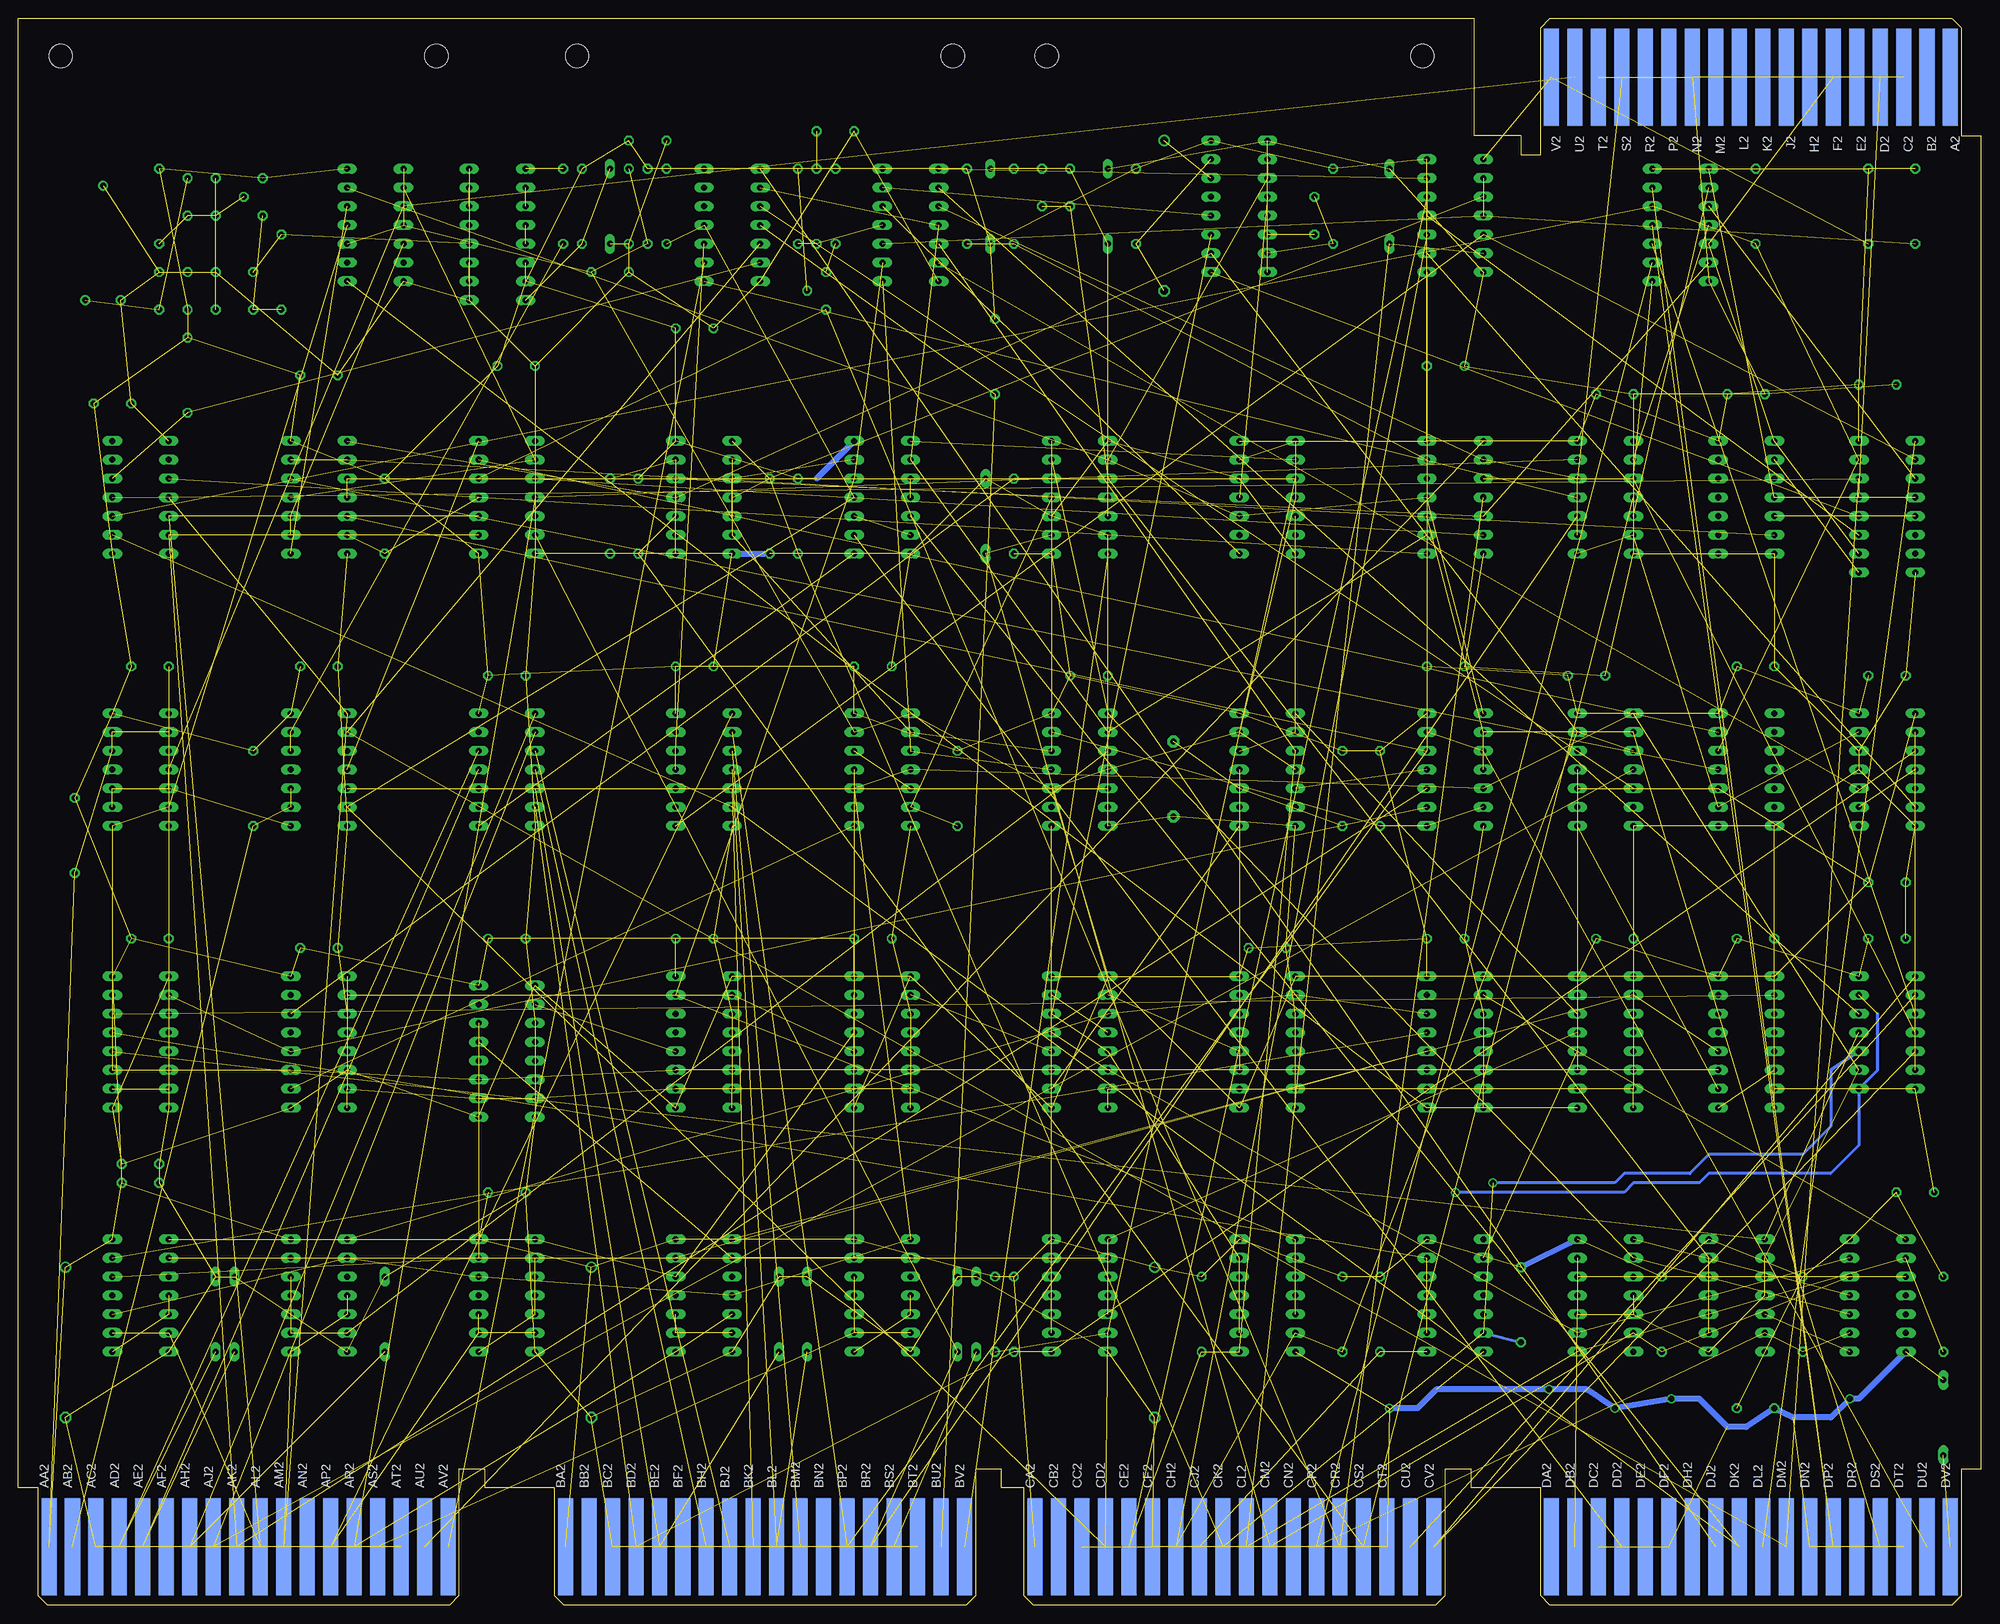
[diagram p3: board, bottom side, seen from below]

Size 265.43 x 214.63 mm. Coordinates in mm from the lower left corner, seen from the top.
Outline: 0,198.75 0,18.41 0.16,18.41
Outline: 265.43,15.88 265.43,214.63 68.58,214.63 68.58,198.75 62.23,198.75 62.23,196.22 62.07,196.22
Copper layers (1+16): Top 0.035mm / dielectric 1.5mm / Bottom 0.035mm
Design rules "16mils": minimum track width 16mil, minimum drill 32mil, track to track 15mil, track to pad 10mil, pad to pad 10mil, via to via 10mil, smd to smd 10mil, copper to edge 13mil, drill to drill 10mil, minimum pad ring 10mil, minimum via ring 8mil, stop-mask expansion 0mil, vias tented up to drill 0mil, thermal gap 10mil
Holes 3.17 mm at 75.56,209.55 126.36,209.55 139.06,209.55 189.87,209.55 208.91,209.55 259.71,209.55

### Footprints (pad centres in the part's own frame; a part is rotated, then mirrored left to right if it is on the bottom)
C050-025X075 = drill 0.813 octagon: 1 -2.54,0; 2 2.54,0
E12-8 = drill 1.016: + -10.16,0 | drill 1.016 octagon: - 10.16,0
DO35-10 = drill 0.813 long: A 5.08,0; C -5.08,0
DIL14 = drill 0.813 long: 1 -7.62,-3.81; 2 -5.08,-3.81; 3 -2.54,-3.81; 4 0,-3.81; 5 2.54,-3.81; 6 5.08,-3.81; 7 7.62,-3.81; 8 7.62,3.81; 9 5.08,3.81; 10 2.54,3.81; 11 0,3.81; 12 -2.54,3.81; 13 -5.08,3.81; 14 -7.62,3.81
DIL16 = drill 0.813 long: 1 -8.89,-3.81; 2 -6.35,-3.81; 3 -3.81,-3.81; 4 -1.27,-3.81; 5 1.27,-3.81; 6 3.81,-3.81; 7 6.35,-3.81; 8 8.89,-3.81; 9 8.89,3.81; 10 6.35,3.81; 11 3.81,3.81; 12 1.27,3.81; 13 -1.27,3.81; 14 -3.81,3.81; 15 -6.35,3.81; 16 -8.89,3.81
EDGE-CON2 = smd 13.106 x 2.032: A1 7.938,4.128; B1 7.938,7.303; C1 7.938,10.477; D1 7.938,13.652; E1 7.938,16.828; F1 7.938,20.003; H1 7.938,23.177; J1 7.938,26.352; K1 7.938,29.527; L1 7.938,32.703; M1 7.938,35.877; N1 7.938,39.053; P1 7.938,42.227; R1 7.938,45.403; S1 7.938,48.578; T1 7.938,51.752; U1 7.938,54.928; V1 7.938,58.102 | smd 13.106 x 2.032 bottom: A2 7.938,4.128; B2 7.938,7.303; C2 7.938,10.477; D2 7.938,13.652; E2 7.938,16.828; F2 7.938,20.003; H2 7.938,23.177; J2 7.938,26.352; K2 7.938,29.527; L2 7.938,32.703; M2 7.938,35.877; N2 7.938,39.053; P2 7.938,42.227; R2 7.938,45.403; S2 7.938,48.578; T2 7.938,51.752; U2 7.938,54.928; V2 7.938,58.102
TO5 = drill 0.813 octagon: 1 0,-2.54; 2 2.54,0; 3 0,2.54
0207/10 = drill 0.813 octagon: 1 -5.08,0; 2 5.08,0
EDGE-CON8 = smd 2.032 x 13.106: AA1 261.303,7.938; AB1 258.127,7.938; AC1 254.952,7.938; AD1 251.778,7.938; AE1 248.602,7.938; AF1 245.428,7.938; AH1 242.252,7.938; AJ1 239.077,7.938; AK1 235.903,7.938; AL1 232.727,7.938; AM1 229.553,7.938; AN1 226.377,7.938; AP1 223.202,7.938; AR1 220.028,7.938; AS1 216.852,7.938; AT1 213.678,7.938; AU1 210.502,7.938; AV1 207.327,7.938; BA1 191.452,7.938; BB1 188.278,7.938; BC1 185.102,7.938; BD1 181.928,7.938; BE1 178.752,7.938; BF1 175.577,7.938; BH1 172.403,7.938; BJ1 169.227,7.938; BK1 166.053,7.938; BL1 162.877,7.938; BM1 159.702,7.938; BN1 156.528,7.938; BP1 153.352,7.938; BR1 150.178,7.938; BS1 147.002,7.938; BT1 143.827,7.938; BU1 140.653,7.938; BV1 137.477,7.938; CA1 127.953,7.938; CB1 124.778,7.938; CC1 121.603,7.938; CD1 118.427,7.938; CE1 115.252,7.938; CF1 112.078,7.938; CH1 108.903,7.938; CJ1 105.728,7.938; CK1 102.552,7.938; CL1 99.377,7.938; CM1 96.203,7.938; CN1 93.028,7.938; CP1 89.853,7.938; CR1 86.677,7.938; CS1 83.502,7.938; CT1 80.328,7.938; CU1 77.153,7.938; CV1 73.978,7.938; DA1 58.102,7.938; DB1 54.928,7.938; DC1 51.752,7.938; DD1 48.578,7.938; DE1 45.403,7.938; DF1 42.227,7.938; DH1 39.053,7.938; DJ1 35.877,7.938; DK1 32.703,7.938; DL1 29.527,7.938; DM1 26.352,7.938; DN1 23.177,7.938; DP1 20.003,7.938; DR1 16.828,7.938; DS1 13.652,7.938; DT1 10.477,7.938; DU1 7.303,7.938; DV1 4.128,7.938 | smd 2.032 x 13.106 bottom: AA2 261.303,7.938; AB2 258.127,7.938; AC2 254.952,7.938; AD2 251.778,7.938; AE2 248.602,7.938; AF2 245.428,7.938; AH2 242.252,7.938; AJ2 239.077,7.938; AK2 235.903,7.938; AL2 232.727,7.938; AM2 229.553,7.938; AN2 226.377,7.938; AP2 223.202,7.938; AR2 220.028,7.938; AS2 216.852,7.938; AT2 213.678,7.938; AU2 210.502,7.938; AV2 207.327,7.938; BA2 191.452,7.938; BB2 188.278,7.938; BC2 185.102,7.938; BD2 181.928,7.938; BE2 178.752,7.938; BF2 175.577,7.938; BH2 172.403,7.938; BJ2 169.227,7.938; BK2 166.053,7.938; BL2 162.877,7.938; BM2 159.702,7.938; BN2 156.528,7.938; BP2 153.352,7.938; BR2 150.178,7.938; BS2 147.002,7.938; BT2 143.827,7.938; BU2 140.653,7.938; BV2 137.477,7.938; CA2 127.953,7.938; CB2 124.778,7.938; CC2 121.603,7.938; CD2 118.427,7.938; CE2 115.252,7.938; CF2 112.078,7.938; CH2 108.903,7.938; CJ2 105.728,7.938; CK2 102.552,7.938; CL2 99.377,7.938; CM2 96.203,7.938; CN2 93.028,7.938; CP2 89.853,7.938; CR2 86.677,7.938; CS2 83.502,7.938; CT2 80.328,7.938; CU2 77.153,7.938; CV2 73.978,7.938; DA2 58.102,7.938; DB2 54.928,7.938; DC2 51.752,7.938; DD2 48.578,7.938; DE2 45.403,7.938; DF2 42.227,7.938; DH2 39.053,7.938; DJ2 35.877,7.938; DK2 32.703,7.938; DL2 29.527,7.938; DM2 26.352,7.938; DN2 23.177,7.938; DP2 20.003,7.938; DR2 16.828,7.938; DS2 13.652,7.938; DT2 10.477,7.938; DU2 7.303,7.938; DV2 4.128,7.938
0R/10 = drill 0.813 pad 1.6 octagon: 1 -5.08,0; 2 5.08,0
HC49TL-H = drill 0.813: 1 -2.413,-7.62; 2 2.413,-7.62; 3 0,7.874
DIL14S = drill 0.813: 1 -7.62,-3.81; 7 7.62,-3.81; 8 7.62,3.81; 14 -7.62,3.81

### Placement (x,y rotation side)
C1  248.92,57.15 180 top
C2  247.65,90.17 180 top
C3  247.65,127 180 top
C4  252.73,162.56 180 top
C5  224.79,88.9 180 top
C6  224.79,127 180 top
C7  224.79,166.37 180 top
C8  199.39,55.88 180 top
C9  199.39,90.17 180 top
C10  199.39,125.73 180 top
C11  198.12,167.64 180 top
C12  173.99,90.17 180 top
C13  173.99,127 180 top
C14  173.99,172.72 180 top
C15  180.34,198.12 180 top
C16  149.86,90.17 180 top
C17  149.86,127 180 top
C18  154.94,199.39 180 top
C19  120.65,125.73 180 top
C20  96.52,88.9 180 top
C21  72.39,90.17 180 top
C22  72.39,127 180 top
C23  72.39,167.64 180 top
C24  49.53,90.17 180 top
C25  53.34,125.73 180 top
C26  49.53,163.83 180 top
C27  30.48,26.67 180 top
C28  30.48,90.17 180 top
C29  30.48,127 180 top
C30  31.75,163.83 180 top
C31  8.89,55.88 180 top
C32  12.7,90.17 180 top
C33  12.7,125.73 180 top
C34  13.97,165.1 180 top
C35  110.49,187.96 270 top
C36  259.08,35.56 270 top
C37  187.96,35.56 270 top
C38  111.76,35.56 270 top
C39  123.19,191.77 90 top
C40  127,191.77 90 top
C41  242.57,177.8 90 top
C42  246.38,177.8 90 top
C43  242.57,190.5 90 top
C44  238.76,177.8 90 top
C45  238.76,190.5 90 top
C46  233.68,177.8 90 top
C47  185.42,180.34 180 top
C48  90.17,187.96 90 top
C49  12.7,97.79 180 top
C50  248.92,59.69 180 top
D1  238.76,39.37 90 top
D2  236.22,39.37 90 top
D3  215.9,39.37 90 top
D4  162.56,39.37 90 top
D5  158.75,39.37 90 top
D6  138.43,39.37 90 top
D7  135.89,39.37 90 top
D8  5.08,25.4 90 top
D9  185.42,189.23 90 top
D10  134.62,147.32 90 top
D11  118.11,189.23 90 top
D12  133.99,189.23 90 top
D13  80.01,189.23 90 top
E01  248.92,41.91 270 top
E02  248.92,76.2 270 top
E03  248.92,113.03 270 top
E04  248.92,149.86 270 top
E05  224.79,41.91 270 top
E06  224.79,76.2 270 top
E07  224.79,113.03 270 top
E08  224.79,149.86 270 top
E09  217.17,186.69 270 top
E10  199.39,41.91 270 top
E11  199.39,74.93 270 top
E12  199.39,113.03 270 top
E13  199.39,149.86 270 top
E14  172.72,41.91 270 top
E15  172.72,76.2 270 top
E16  172.72,113.03 270 top
E17  172.72,149.86 270 top
E18  168.91,186.69 270 top
E19  148.59,41.91 270 top
E20  148.59,76.2 270 top
E21  148.59,113.03 270 top
E22  148.59,149.86 270 top
E23  144.78,186.69 270 top
E24  121.92,41.91 270 top
E25  121.92,76.2 270 top
E26  121.92,113.03 270 top
E27  121.92,149.86 270 top
E28  96.52,41.91 270 top
E29  96.52,76.2 270 top
E30  96.52,113.03 270 top
E31  96.52,149.86 270 top
E32  100.33,189.23 270 top
E33  71.12,41.91 270 top
E34  71.12,76.2 270 top
E35  71.12,113.03 270 top
E36  71.12,149.86 270 top
E37  71.12,187.96 270 top
E38  50.8,41.91 270 top
E39  50.8,76.2 270 top
E40  50.8,113.03 270 top
E41  50.8,149.86 270 top
E42  40.64,186.69 270 top
E43  33.02,41.91 270 top
E44  31.75,76.2 270 top
E45  31.75,113.03 270 top
E46  31.75,149.86 270 top
E47  13.97,41.91 270 top
E48  12.7,77.47 270 top
E49  12.7,113.03 270 top
E50  12.7,148.59 270 top
J  0,214.63 270 top
Q1  156.21,177.8 0 top
Q2  232.41,190.5 0 top
R1  137.16,189.23 90 top
R2  130.81,189.23 90 top
R3  62.23,40.64 90 top
R4  133.35,39.37 90 top
R5  246.38,189.23 90 top
R6  229.87,180.34 90 top
R7  189.23,189.23 90 top
R8  191.77,189.23 270 top
R9  5.08,39.37 90 top
R10  105.41,39.37 90 top
R11  233.68,110.49 90 top
R12  257.81,104.14 90 top
R13  43.18,39.37 90 top
R14  86.36,39.37 90 top
R15  86.36,110.49 90 top
R16  24.13,39.37 90 top
R17  81.28,39.37 90 top
R18  138.43,110.49 90 top
R19  81.28,110.49 90 top
R20  160.02,147.32 90 top
R21  163.83,147.32 90 top
R22  130.81,147.32 90 top
R23  130.81,39.37 90 top
R24  180.34,189.23 90 top
R25  182.88,189.23 90 top
R26  87.63,189.23 90 top
R27  114.3,189.23 90 top
R28  177.8,189.23 90 top
R29  30.48,189.23 90 top
R30  215.9,147.32 90 top
R31  160.02,189.23 90 top
R32  157.48,189.23 90 top
R33  154.94,189.23 90 top
R34  185.42,147.32 90 top
R35  181.61,147.32 90 top
R36  15.24,189.23 90 top
R37  8.89,189.23 90 top
R38  242.57,166.37 90 top
R39  133.35,168.91 90 top
T1  200.66,185.42 270 top
U$2  0,0 0 top
W1  109.22,111.76 90 top
Y1A  254,184.15 0 top
Y1B  200.66,186.69 90 top

### Tracks (layer width: path | path; a pad name or v marks a point on that pad's centre or on a via)
!BK_CYCLE  (1 unrouted)
!BK_IN_PROG  (1 unrouted)
!BUS_STROBE  (5 unrouted)
!C0  (1 unrouted)
!C1  (1 unrouted)
!CAF  (1 unrouted)
!DATA00  (2 unrouted)
!DATA02  (1 unrouted)
!DATA04  (1 unrouted)
!DEFER  (1 unrouted)
!EMA0  (1 unrouted)
!EMA1  (1 unrouted)
!EMA2  (1 unrouted)
!F_SET  (1 unrouted)
!FAST  (2 unrouted)
!FAULT  (17 unrouted)
!FETCH  (1 unrouted)
!GTF  (3 unrouted)
!INT_RQ  (1 unrouted)
!INTERNAL_IO  (2 unrouted)
!IO_PAUSE  (4 unrouted)
!IOF  (1 unrouted)
!ION  (1 unrouted)
!KEY_CONTROL  (2 unrouted)
!LINK  (1 unrouted)
!LINK_DATA  (1 unrouted)
!LINK_LOAD  (4 unrouted)
!MA00  (1 unrouted)
!MA01  (1 unrouted)
!MA02  (1 unrouted)
!MA03  (1 unrouted)
!MA04  (1 unrouted)
!MA05  (1 unrouted)
!MA06  (1 unrouted)
!MA07  (1 unrouted)
!MA08  (1 unrouted)
!MD00  (2 unrouted)
!MD01  (2 unrouted)
!MD02  (2 unrouted)
!MD03  (2 unrouted)
!MD04  (1 unrouted)
!MD05  (1 unrouted)
!MD06  (1 unrouted)
!MD07  (1 unrouted)
!MD08  (1 unrouted)
!MD09  (1 unrouted)
!MD10  (2 unrouted)
!MD11  (1 unrouted)
!MD_DIR  (1 unrouted)
!MEM_START  (1 unrouted)
!NOT_LAST  (4 unrouted)
!NOT_LAST_XFR  (2 unrouted)
!NS1400B  (3 unrouted)
!POWER_NOT_OK  (7 unrouted)
!RTF  (3 unrouted)
!RUN  (2 unrouted)
!SGT  (1 unrouted)
!SKIP  (2 unrouted)
!SKON  (2 unrouted)
!SRQ  (1 unrouted)
!STALL  (2 unrouted)
!STOP  (4 unrouted)
!STROBE  (4 unrouted)
!TS1  (via drill 0.81)  (2 unrouted)
  Bottom 0.406: E48.10 20.32,72.39 20.32,64.77 24.13,60.96 36.83,60.96 39.37,58.42 48.26,58.42 49.53,57.15 v66.04,57.15 | E33.6 R3.1
!TS2  (3 unrouted)
!TS3  (3 unrouted)
!TS4  (3 unrouted)
!USER_MODE  (2 unrouted)
+3V3  (41 unrouted)
DO_GTF  (4 unrouted)
EAE_CLOCK  (6 unrouted)
F_SET  (1 unrouted)
FETCH  (4 unrouted)
GND  (via drill 0.81)  (197 unrouted)
  Top 0.813: C27.2 29.21,27.94 E43.7 | E38.7 45.72,33.02 45.72,27.94 46.99,26.67 v49.53,26.67
  Bottom 0.813: E47.7 16.51,27.94 v17.78,27.94 20.32,25.4 25.4,25.4 C27.2 31.75,24.13 34.29,24.13 38.1,27.94 v41.91,27.94 v49.53,26.67 53.34,29.21 v58.42,29.21 73.66,29.21 76.2,26.67 v80.01,26.67 | E17.7 R21.1
IND1  (1 unrouted)
IND2  (1 unrouted)
INHIBIT  (3 unrouted)
INITIALIZE  (2 unrouted)
INT_DELAY  (1 unrouted)
INT_ENB  (3 unrouted)
INT_IN_PROG  (3 unrouted)
INT_RQ  (3 unrouted)
INT_STROBE  (3 unrouted)
IO_TIME  (1 unrouted)
MD11  (4 unrouted)
MSIR_DISABLE  (1 unrouted)
N$1  (2 unrouted)
N$2  (3 unrouted)
N$3  (1 unrouted)
N$4  (1 unrouted)
N$5  (2 unrouted)
N$6  (1 unrouted)
N$7  (2 unrouted)
N$8  (2 unrouted)
N$9  (1 unrouted)
N$11  (2 unrouted)
N$12  (5 unrouted)
N$13  (3 unrouted)
N$14  (1 unrouted)
N$15  (2 unrouted)
N$16  (2 unrouted)
N$17  (2 unrouted)
N$18  (2 unrouted)
N$19  (1 unrouted)
N$20  (1 unrouted)
N$21  (1 unrouted)
N$22  (1 unrouted)
N$23  (2 unrouted)
N$24  (1 unrouted)
N$25  (3 unrouted)
N$26  (6 unrouted)
N$27  (6 unrouted)
N$28  (3 unrouted)
N$29  (2 unrouted)
N$30  (1 unrouted)
N$31  (2 unrouted)
N$32  (1 unrouted)
N$33  (1 unrouted)
N$34  (1 unrouted)
N$35  (1 unrouted)
N$36  (1 unrouted)
N$37  (1 unrouted)
N$38  (2 unrouted)
N$39  (2 unrouted)
N$40  (1 unrouted)
N$41  (2 unrouted)
N$42  (1 unrouted)
N$44  (1 unrouted)
N$45  (1 unrouted)
N$46  (2 unrouted)
N$47  (1 unrouted)
N$48  (2 unrouted)
N$49  (3 unrouted)
N$50  (1 unrouted)
N$51  (2 unrouted)
N$53  (1 unrouted)
N$54  (1 unrouted)
N$55  (2 unrouted)
N$56  (2 unrouted)
N$57  (1 unrouted)
N$58  (2 unrouted)
N$59  (1 unrouted)
N$60  (4 unrouted)
N$61  (1 unrouted)
N$62  (1 unrouted)
N$63  (1 unrouted)
N$64  (1 unrouted)
N$66  (1 unrouted)
N$67  (2 unrouted)
N$69  (1 unrouted)
N$70  (1 unrouted)
N$71  (2 unrouted)
N$72  (1 unrouted)
N$73  (1 unrouted)
N$74  (1 unrouted)
N$75  (1 unrouted)
N$77  (3 unrouted)
N$78  (1 unrouted)
NS200  (3 unrouted)
NS300  (1 unrouted)
NS350  (5 unrouted)
NS400  (3 unrouted)
  Top 0.406: E33.5 E33.4 68.58,43.18 68.58,45.72 E33.2
NS500  (3 unrouted)
NS550  (1 unrouted)
NS600  (1 unrouted)
NS800  (1 unrouted)
NS900  (6 unrouted)
NS950  (3 unrouted)
NS1000  (1 unrouted)
NS1050  (1 unrouted)
NS1150  (3 unrouted)
NS1200  (2 unrouted)
NS1250  (6 unrouted)
NS1300  (2 unrouted)
NS1400A  (1 unrouted)
NS1400B  (2 unrouted)
NS1500A  (2 unrouted)
NS1500B  (1 unrouted)
NS1550A  (2 unrouted)
NS1550B  (4 unrouted)
NS1600  (2 unrouted)
OSC  (15 unrouted)
POWER_OK  (1 unrouted)
PWR_UP  (1 unrouted)
RES2  (1 unrouted)
RETURN  (2 unrouted)
RUN  (2 unrouted)
SET_TS4  (3 unrouted)
SOURCE  (2 unrouted)
STROBE  (3 unrouted)
SW  (1 unrouted)
TP1  (5 unrouted)
TP2  (4 unrouted)
TP3  (8 unrouted)
TP4  (2 unrouted)
TS1  (via drill 0.81)  (1 unrouted)
  Top 0.406: E33.1 71.12,52.07 v71.12,55.88
  Bottom 0.406: v71.12,55.88 48.26,55.88 46.99,57.15 38.1,57.15 36.83,58.42 20.32,58.42 16.51,62.23 E48.8 13.97,72.39 13.97,80.01
USER_MODE  (2 unrouted)
VCC  (124 unrouted)
  Bottom 0.813: E38.14 R3.2 | E22.14 157.48,152.4
WRITE  (4 unrouted)

### Text on the board
200bmp: C:/Users/Vince/Documents/eagle/projects/DEC/Mxxx/M8330/M8330Eback2fb.bmp